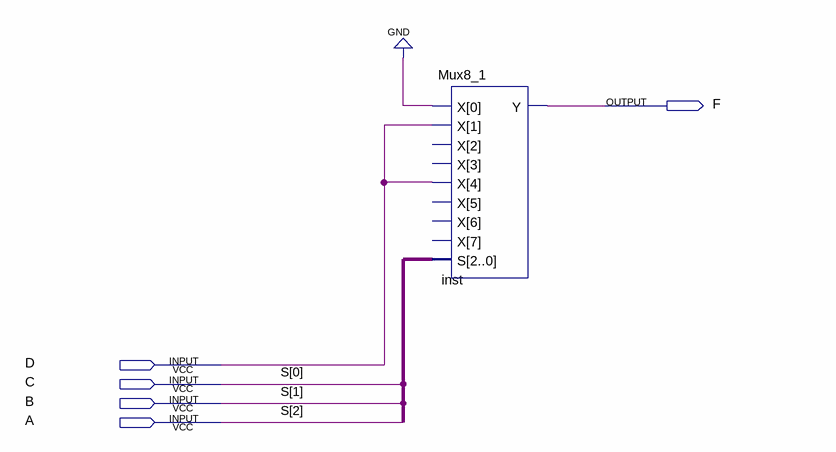
[diagram p0: schematic sheet]
// Quartus schematic TentativaDemo.bdf as structural Verilog: 1 symbols, 5 pins
module TentativaDemo (
  input  D,
  input  C,
  input  B,
  input  A,
  output F
);

  wire [2:0] undriven;

  Mux8_1 inst (.X({3'bzzz, D, 2'bzz, D, 1'b0}), .S(undriven), .Y(F));

  // Other names for the same wires on the sheet: S[2:0] = {A, B, C}
endmodule
